# EAGLE design mbed-014.1 (EAGLE 6.2)

## Sheet 1 of 3
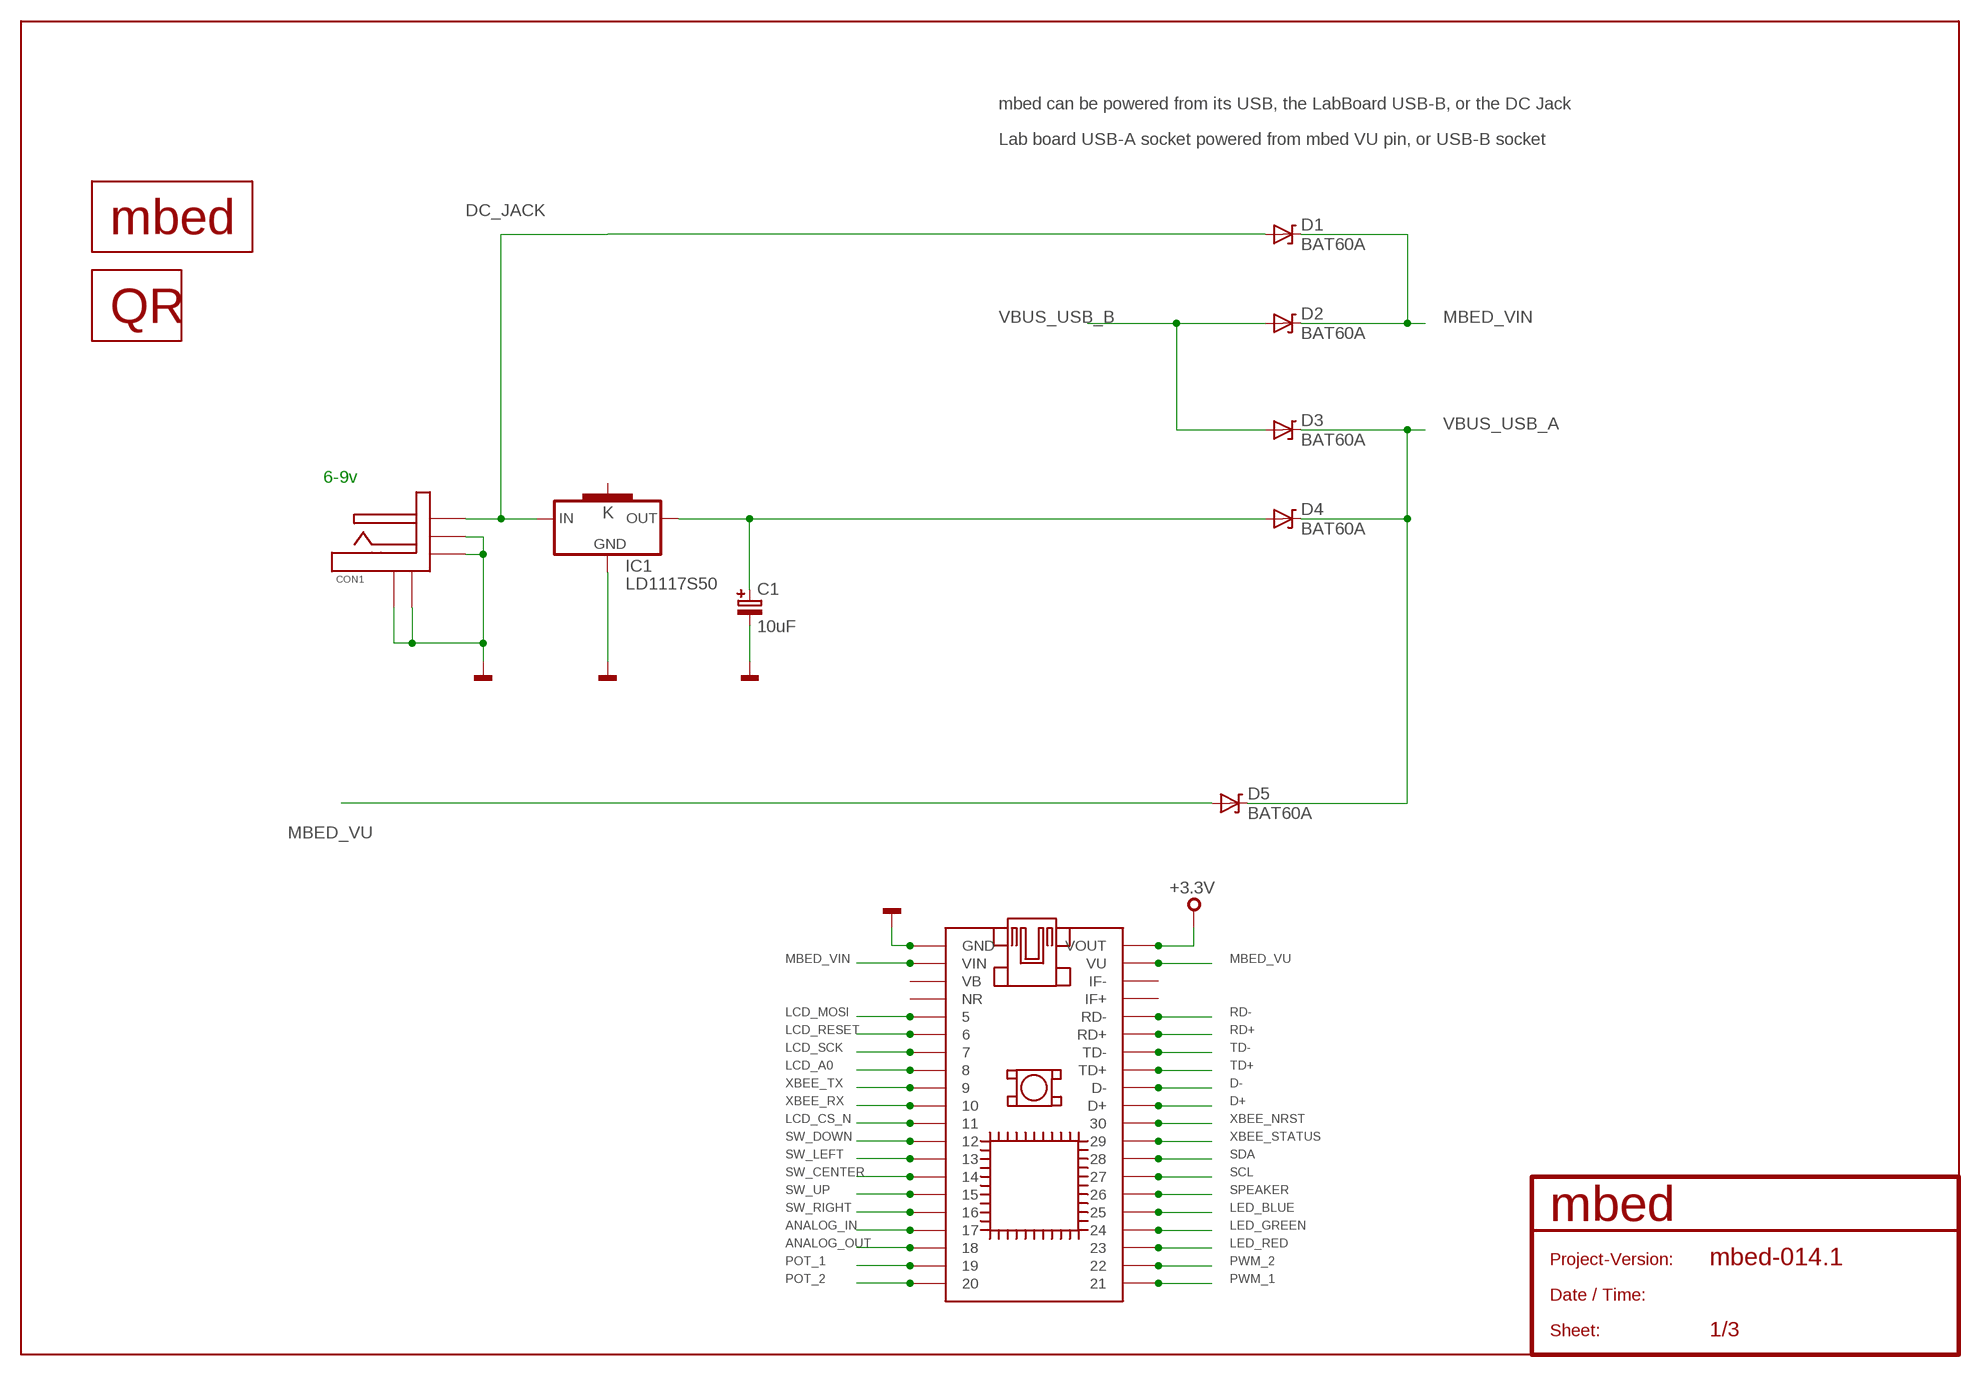
[diagram p0: schematic, sheet 1]

### Parts
C1  10uF  C-POLARISEDSMT_TANTALUM  [C106B]
CON1  FC68145S  [FC68145S]
D1  BAT60A  [BAT60A]
D2  BAT60A  [BAT60A]
D3  BAT60A  [BAT60A]
D4  BAT60A  [BAT60A]
D5  BAT60A  [BAT60A]
IC1  LD1117S50  LD1117S33  [SOT223]
IC2  MBED-SOCKET  [MBED-SOCKET]
QR1  QR-CODE-APP  [QR-MBED-APP-BOARD]
U$1  MBED-LOGO-BIG  [MBED-LOGO-BIG]

### Nets
+3,3V: IC2.VOUT IC2.VOUTA ; supply symbol labelled +3.3V ; also sheet 2,3
ANALOG_IN: IC2.17 IC2.17A ; also sheet 2
ANALOG_OUT: IC2.18 IC2.18A ; also sheet 2
D+: IC2.D+ IC2.D+A ; also sheet 2
D-: IC2.D- IC2.D-A ; also sheet 2
DC_JACK: CON1.TIP D1.A IC1.3(IN) ; also sheet 2
GND: C1.2 CON1.CASE1 CON1.P$5(CASE2) CON1.SHUNT(SWITCHED) CON1.SLEEVE IC1.1(GND) IC2.GND IC2.GNDA ; also sheet 2,3
LCD_A0: IC2.8 IC2.8A ; also sheet 2
LCD_CS_N: IC2.11 IC2.11A ; also sheet 2
LCD_MOSI: IC2.5 IC2.5A ; also sheet 2
LCD_RESET: IC2.6 IC2.6A ; also sheet 2
LCD_SCK: IC2.7 IC2.7A ; also sheet 2
LED_BLUE: IC2.25 IC2.25A ; also sheet 2
LED_GREEN: IC2.24 IC2.24A ; also sheet 2
LED_RED: IC2.23 IC2.23A ; also sheet 2
MBED_VIN: D1.K D2.K IC2.VIN IC2.VINA
MBED_VU: D5.A IC2.VU IC2.VUA
N$2: C1.1 D4.A IC1.2(OUT)
POT_1: IC2.19 IC2.19A ; also sheet 2
POT_2: IC2.20 IC2.20A ; also sheet 2
PWM_1: IC2.21 IC2.21A ; also sheet 2
PWM_2: IC2.22 IC2.22A ; also sheet 2
RD+: IC2.RD+ IC2.RD+A ; also sheet 2
RD-: IC2.RD- IC2.RD-A ; also sheet 2
SCL: IC2.27 IC2.27A ; also sheet 2
SDA: IC2.28 IC2.28A ; also sheet 2
SPEAKER: IC2.26 IC2.26A ; also sheet 2
SW_CENTER: IC2.14 IC2.14A ; also sheet 2
SW_DOWN: IC2.12 IC2.12A ; also sheet 2
SW_LEFT: IC2.13 IC2.13A ; also sheet 2
SW_RIGHT: IC2.16 IC2.16A ; also sheet 2
SW_UP: IC2.15 IC2.15A ; also sheet 2
TD+: IC2.TD+ IC2.TD+A ; also sheet 2
TD-: IC2.TD- IC2.TD-A ; also sheet 2
VBUS_USB_A: D3.K D4.K D5.K ; also sheet 2
VBUS_USB_B: D2.A D3.A ; also sheet 2
XBEE_NRST: IC2.30 IC2.30A ; also sheet 3
XBEE_RX: IC2.10 IC2.10A ; also sheet 3
XBEE_STATUS: IC2.29 IC2.29A ; also sheet 3
XBEE_TX: IC2.9 IC2.9A ; also sheet 3
Unconnected: IC1.4(K) IC2.IF+ IC2.IF+A IC2.IF- IC2.IF-A IC2.NR IC2.NRA IC2.VB IC2.VBA

### Notes on the sheet
- mbed can be powered from its USB, the LabBoard USB-B, or the DC Jack
- Lab board USB-A socket powered from mbed VU pin, or USB-B socket
- 6-9v

## Sheet 2 of 3
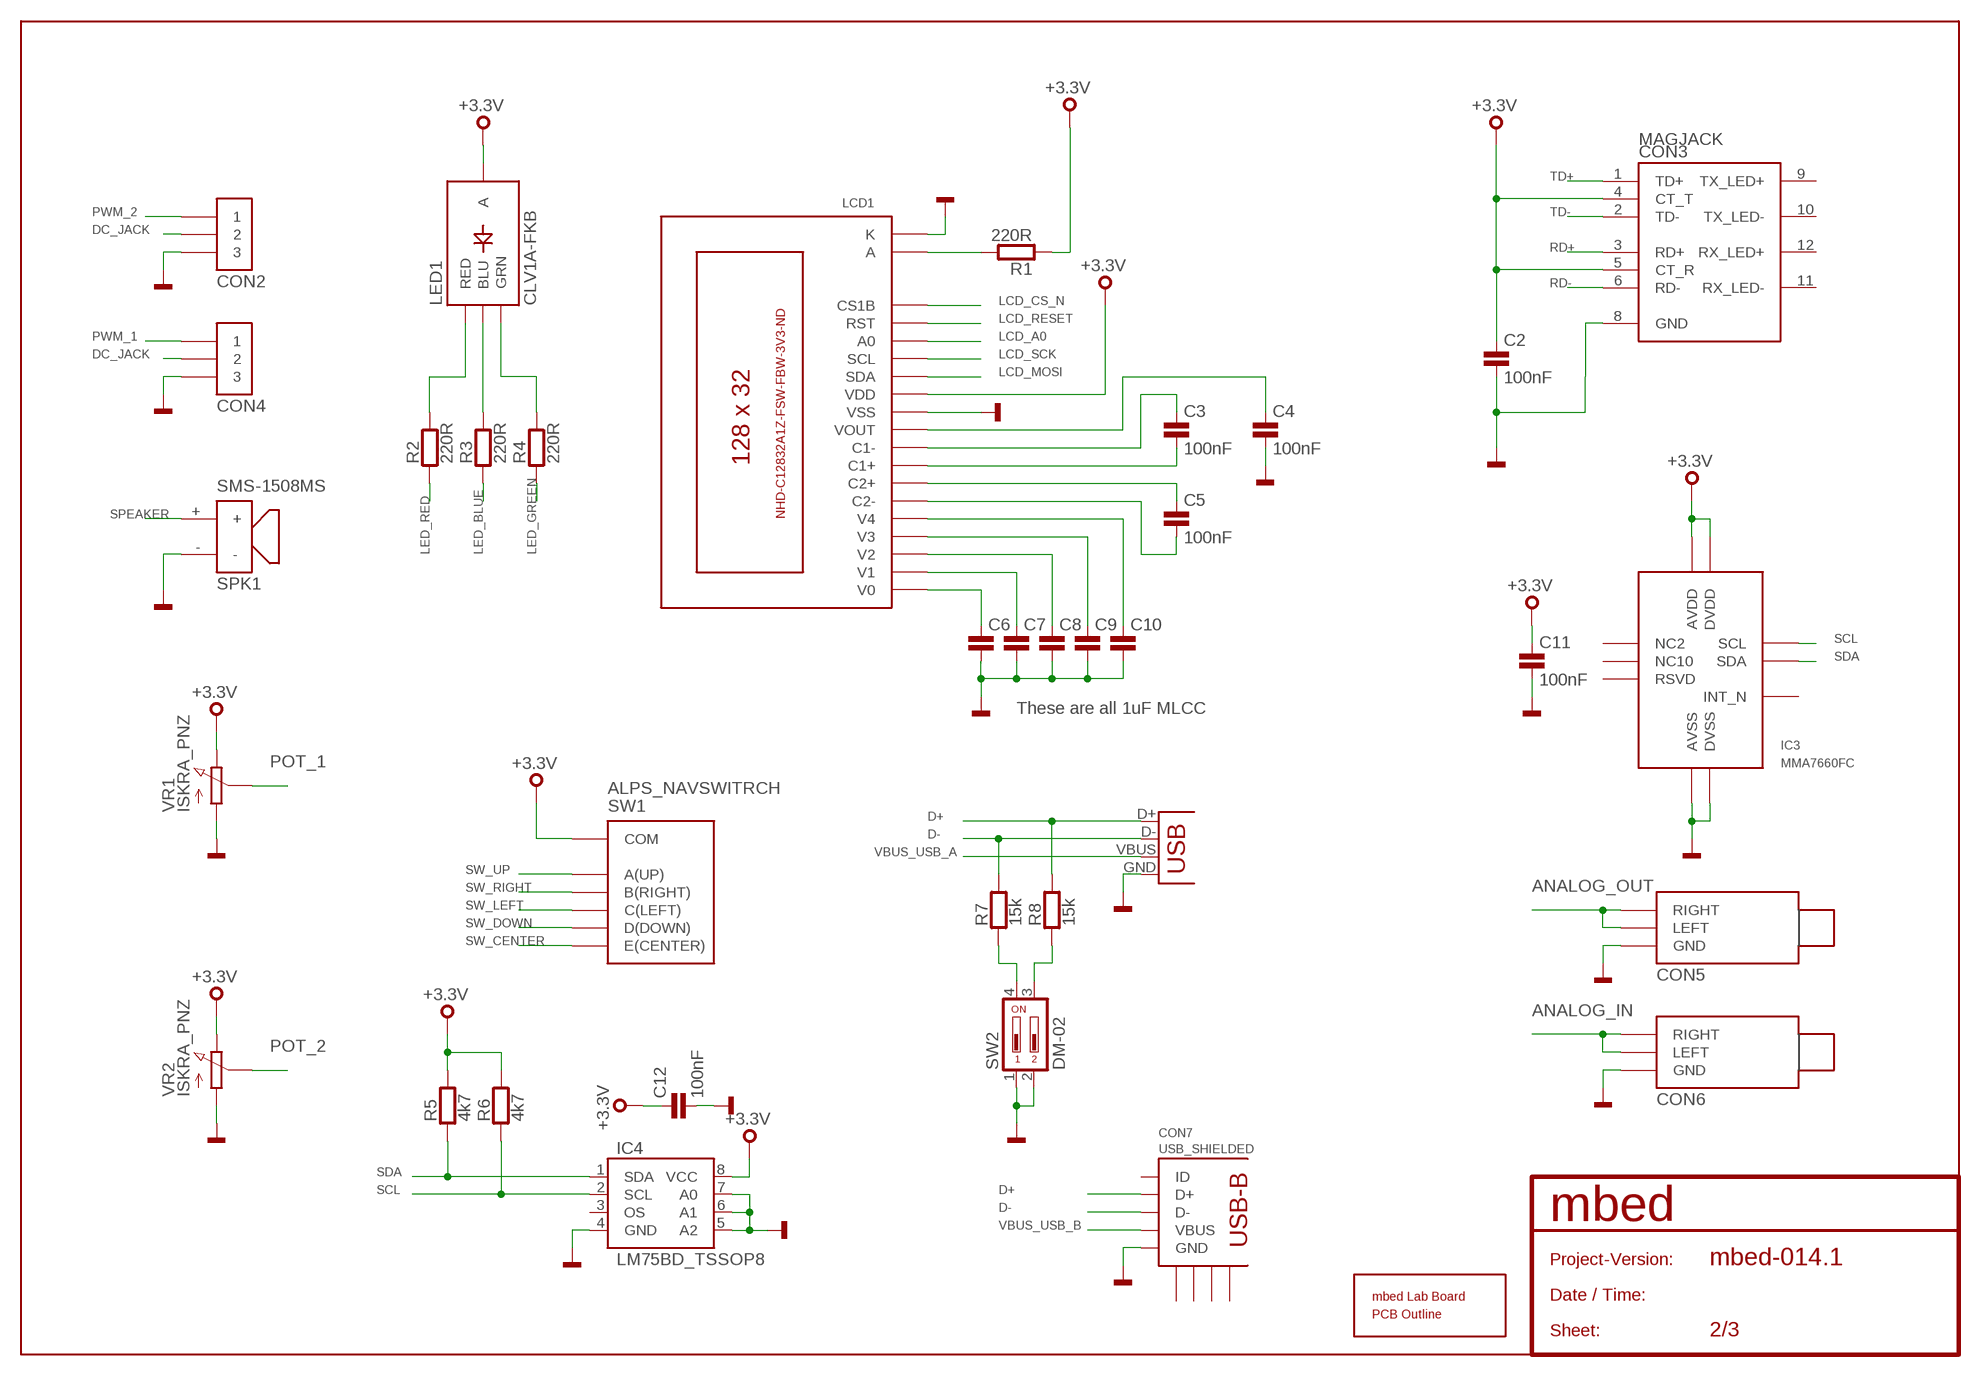
[diagram p1: schematic, sheet 2]

### Parts
C2  100nF  C0402  [0402]
C3  100nF  C0402  [0402]
C4  100nF  C0402  [0402]
C5  100nF  C0402  [0402]
C6  100nF  C0402  [0402]
C7  100nF  C0402  [0402]
C8  100nF  C0402  [0402]
C9  100nF  C0402  [0402]
C10  100nF  C0402  [0402]
C11  100nF  C0402  [0402]
C12  100nF  C0402  [0402]
CON2  1X3-HOLES  [1X3-HOLES]
CON3  MAGJACK  [MAGJACK]
CON4  1X3-HOLES  [1X3-HOLES]
CON5  3.5MM_STEREO  [3.5MM_STEREO]
CON6  3.5MM_STEREO  [3.5MM_STEREO]
CON7  USB_SHIELDED  [5075ABMR-05-SM1]
IC3  MMA7660FC  [DFN10-3X3MM]
IC4  LM75BD_TSSOP8  [TSSOP8]
LCD1  C12832A1Z  [C12832A1Z]
LED1  CLV1A-FKB  [PLCC-4]
PCB1  LAB_BOARD_OUTLINE  [LAB_BOARD_OUTLINE]
R1  220R  R0402  [0402]
R2  220R  R0402  [0402]
R3  220R  R0402  [0402]
R4  220R  R0402  [0402]
R5  4k7  R0402  [0402]
R6  4k7  R0402  [0402]
R7  15k  R0402  [0402]
R8  15k  R0402  [0402]
SPK1  SMS-1508MS  [SMS-1508MS-R]
SW1  ALPS_NAVSWITRCH  [SKRHA_SERIES]
SW2  DM-02  [DM-02]
VR1  ISKRA_PNZ  [CA14V]
VR2  ISKRA_PNZ  [CA14V]
X1  USB-A-V  [USB-A-V]

### Nets
+3,3V: C2.1 C11.1 C12.1 CON3.4(CT_T) CON3.5(CT_R) IC3.P$3(AVDD) IC3.P$9(DVDD) IC4.8(VCC) LCD1.P$12(VDD) LED1.2(A) R1.1 R5.2 R6.2 SW1.P$5(COM) VR1.P$3(E) VR2.P$3(E) ; supply symbol labelled +3.3V ; also sheet 1,3
ANALOG_IN: CON6.P$2(LEFT) CON6.P$3(RIGHT) ; also sheet 1
ANALOG_OUT: CON5.P$2(LEFT) CON5.P$3(RIGHT) ; also sheet 1
D+: CON7.D+ R8.2 X1.D+ ; also sheet 1
D-: CON7.D- R7.2 X1.D- ; also sheet 1
DC_JACK: CON2.P$2 CON4.P$2 ; also sheet 1
GND: C2.2 C4.2 C6.2 C7.2 C8.2 C9.2 C10.2 C11.2 C12.2 CON2.P$3 CON3.8(GND) CON4.P$3 CON5.P$1(GND) CON6.P$1(GND) CON7.GND IC3.P$4(AVSS) IC3.P$8(DVSS) IC4.4(GND) IC4.5(A2) IC4.6(A1) IC4.7(A0) LCD1.K LCD1.P$11(VSS) SPK1.- SW2.1 SW2.2 VR1.P$1(A) VR2.P$1(A) X1.GND ; also sheet 1,3
LCD_A0: LCD1.P$15(A0) ; also sheet 1
LCD_CS_N: LCD1.P$17(CS1B) ; also sheet 1
LCD_MOSI: LCD1.P$13(SDA) ; also sheet 1
LCD_RESET: LCD1.P$16(RST) ; also sheet 1
LCD_SCK: LCD1.P$14(SCL) ; also sheet 1
LED_BLUE: R3.1 ; also sheet 1
LED_GREEN: R4.1 ; also sheet 1
LED_RED: R2.1 ; also sheet 1
N$1: LCD1.A R1.2
N$3: R7.1 SW2.4
N$4: R8.1 SW2.3
N$7: C3.1 LCD1.P$9(C1-)
N$8: C3.2 LCD1.P$8(C1+)
N$9: C5.1 LCD1.P$7(C2+)
N$10: C5.2 LCD1.P$6(C2-)
N$11: C6.1 LCD1.P$1(V0)
N$12: C7.1 LCD1.P$2(V1)
N$14: C8.1 LCD1.P$3(V2)
N$15: C9.1 LCD1.P$4(V3)
N$16: C10.1 LCD1.P$5(V4)
N$17: LED1.1(RED) R2.2
N$18: C4.1 LCD1.P$10(VOUT)
N$19: LED1.4(GRN) R4.2
N$20: LED1.3(BLU) R3.2
POT_1: VR1.P$2(S) ; also sheet 1
POT_2: VR2.P$2(S) ; also sheet 1
PWM_1: CON4.P$1 ; also sheet 1
PWM_2: CON2.P$1 ; also sheet 1
RD+: CON3.3(RD+) ; also sheet 1
RD-: CON3.6(RD-) ; also sheet 1
SCL: IC3.P$6(SCL) IC4.2(SCL) R6.1 ; also sheet 1
SDA: IC3.P$7(SDA) IC4.1(SDA) R5.1 ; also sheet 1
SPEAKER: SPK1.+ ; also sheet 1
SW_CENTER: SW1.P$2(E(CENTER)) ; also sheet 1
SW_DOWN: SW1.P$4(D(DOWN)) ; also sheet 1
SW_LEFT: SW1.P$1(C(LEFT)) ; also sheet 1
SW_RIGHT: SW1.P$6(B(RIGHT)) ; also sheet 1
SW_UP: SW1.P$3(A(UP)) ; also sheet 1
TD+: CON3.1(TD+) ; also sheet 1
TD-: CON3.2(TD-) ; also sheet 1
VBUS_USB_A: X1.VBUS ; also sheet 1
VBUS_USB_B: CON7.VBUS ; also sheet 1
Unconnected: CON3.9(TX_LED+) CON3.10(TX_LED-) CON3.11(RX_LED-) CON3.12(RX_LED+) CON7.ID CON7.SHIELD@1 CON7.SHIELD@2 CON7.SHIELD@3 CON7.SHIELD@4 IC3.P$1(RSVD) IC3.P$2(NC2) IC3.P$5(INT_N) IC3.P$10(NC10) IC4.3(OS)

### Notes on the sheet
- These are all 1uF MLCC

## Sheet 3 of 3
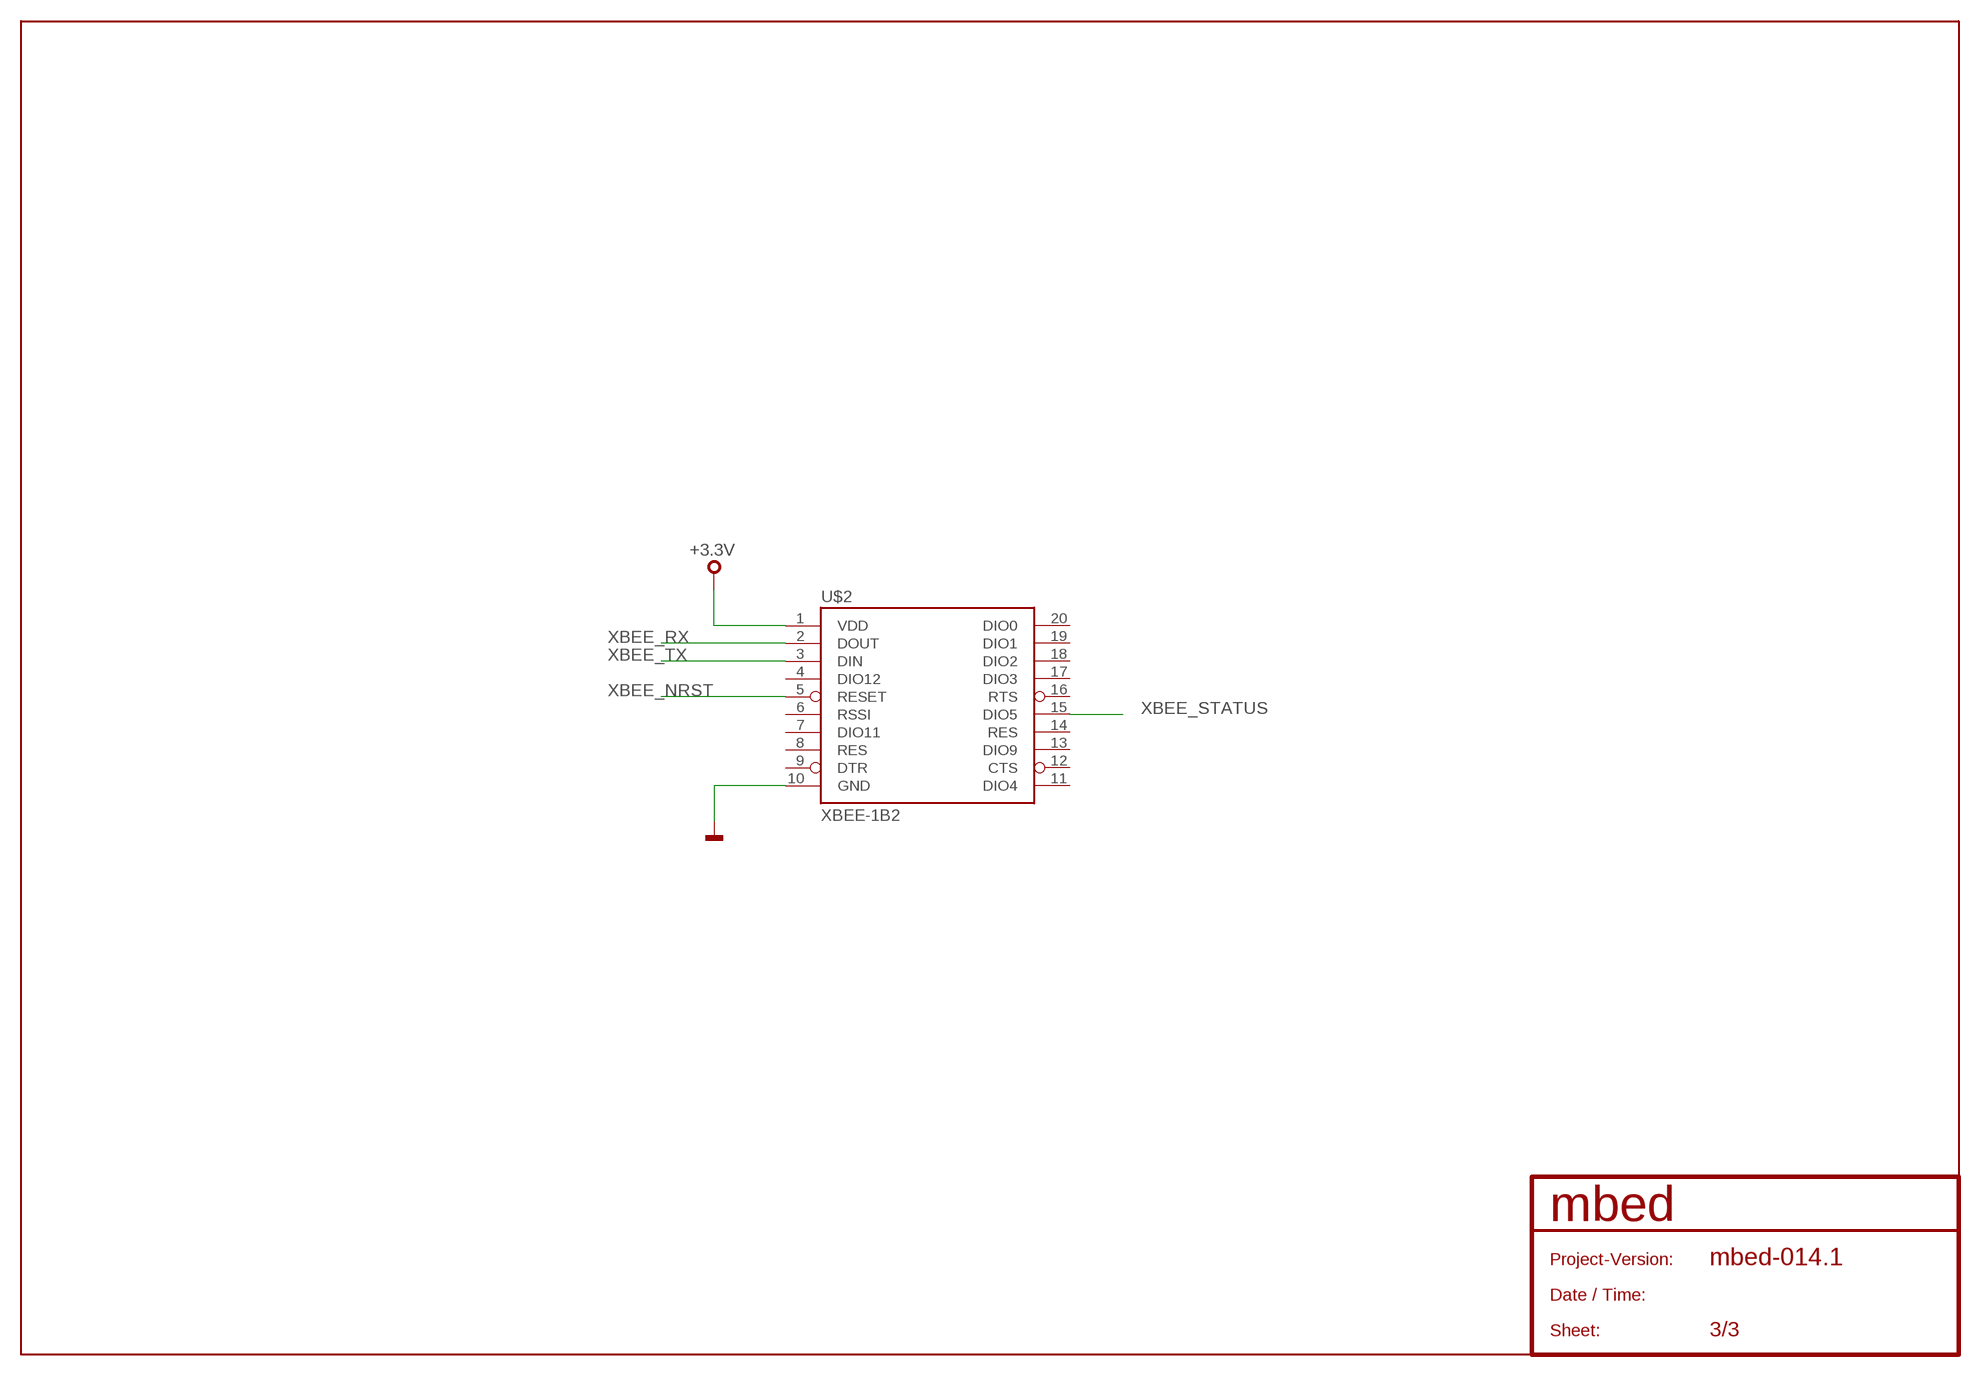
[diagram p2: schematic, sheet 3]

### Parts
U$2  XBEE-1B2  [XBEE-SILK]

### Nets
+3,3V: U$2.1(VDD) ; supply symbol labelled +3.3V ; also sheet 1,2
GND: U$2.10(GND) ; also sheet 1,2
XBEE_NRST: U$2.5(RESET) ; also sheet 1
XBEE_RX: U$2.2(DOUT) ; also sheet 1
XBEE_STATUS: U$2.15(DIO5) ; also sheet 1
XBEE_TX: U$2.3(DIN) ; also sheet 1
Unconnected: U$2.4(DIO12) U$2.6(RSSI) U$2.7(DIO11) U$2.8(RES) U$2.9(DTR) U$2.11(DIO4) U$2.12(CTS) U$2.13(DIO9) U$2.14(RES) U$2.16(RTS) U$2.17(DIO3) U$2.18(DIO2) U$2.19(DIO1) U$2.20(DIO0)

## Library data of the parts
C1 = mbed-rlcq:C-POLARISED
C2-C12 = mbed-rlcq:C
CON1 = LabBoard:FC68145S
CON2 CON4 = LabBoard:1X3-HOLES
CON3 = LabBoard:MAGJACK
CON5 CON6 = LabBoard:3.5MM_STEREO
CON7 = mbed-connectors:USB_SHIELDED
D1-D5 = mbed-discrete:BAT60A
IC1 = mbed-ics:LD1117S33: VOLTAGE REGULATOR SMD 3,3V
IC2 = mbed-microcontroller:MBED-SOCKET
IC3 = LabBoard:MMA7660FC
IC4 = LabBoard:LM75BD
LCD1 = LabBoard:C12832A1Z
LED1 = LabBoard:CLV1A-FKB: Tri-Color LED SMD Proven layout and schematic for triple color LED in SMD package - common anode. Spark Fun Electronics SKU : COM-07844
PCB1 = LabBoard:LAB_BOARD_OUTLINE
QR1 = LabBoard:QR-CODE
R1-R8 = mbed-rlcq:R
SPK1 = LabBoard:SMS-1508MS
SW1 = LabBoard:ALPS_NAVSWITRCH
SW2 = LabBoard:DM-02
U$1 = LabBoard:MBED-LOGO
U$2 = LabBoard:XBEE-1
VR1 VR2 = LabBoard:ISKRA_PNZ
X1 = mbed-connectors:USB: USB Connectors

## Board
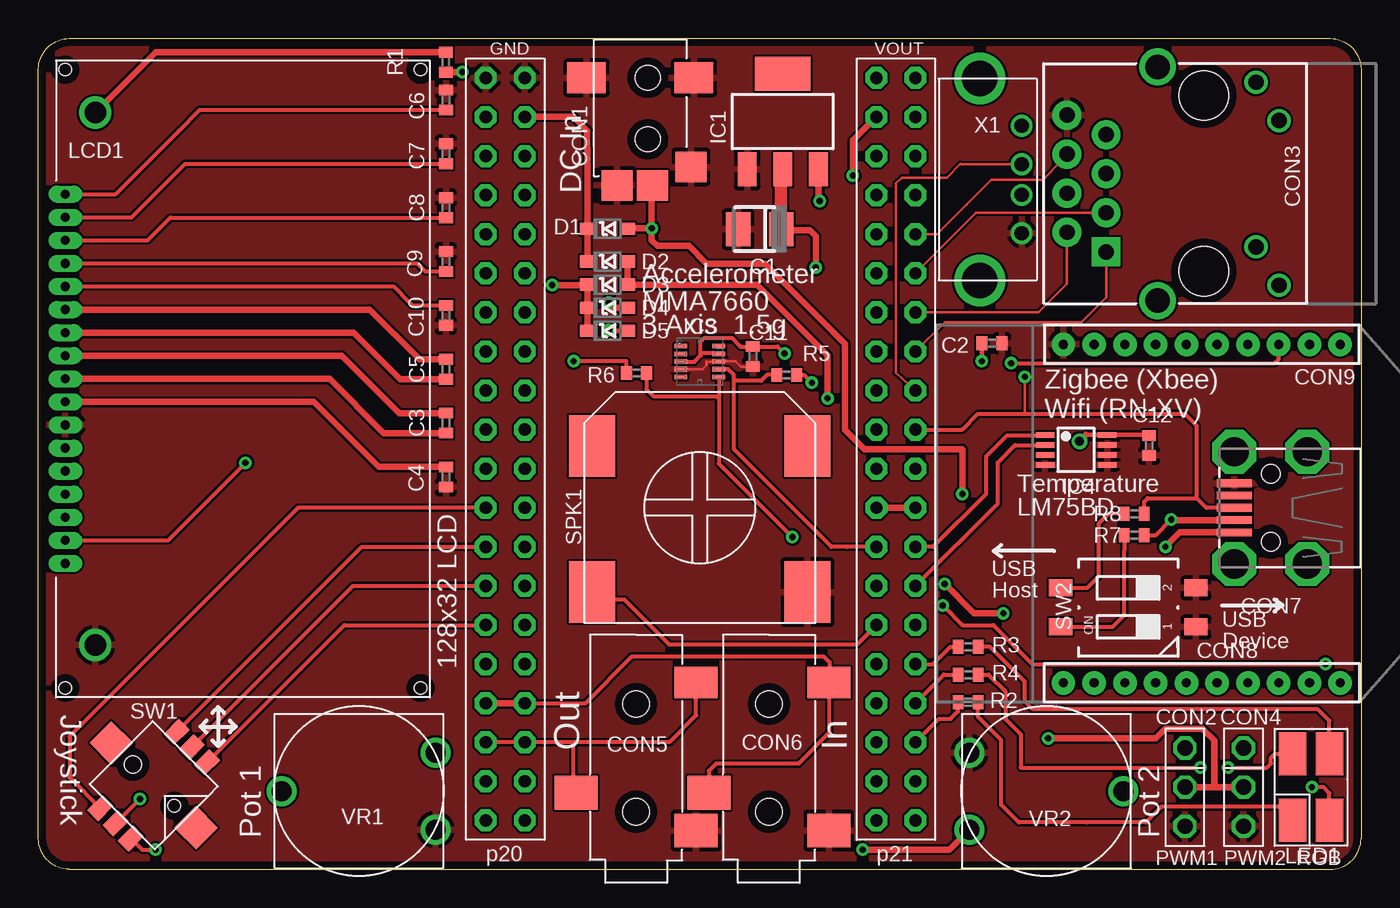
[diagram p3: board, top side]
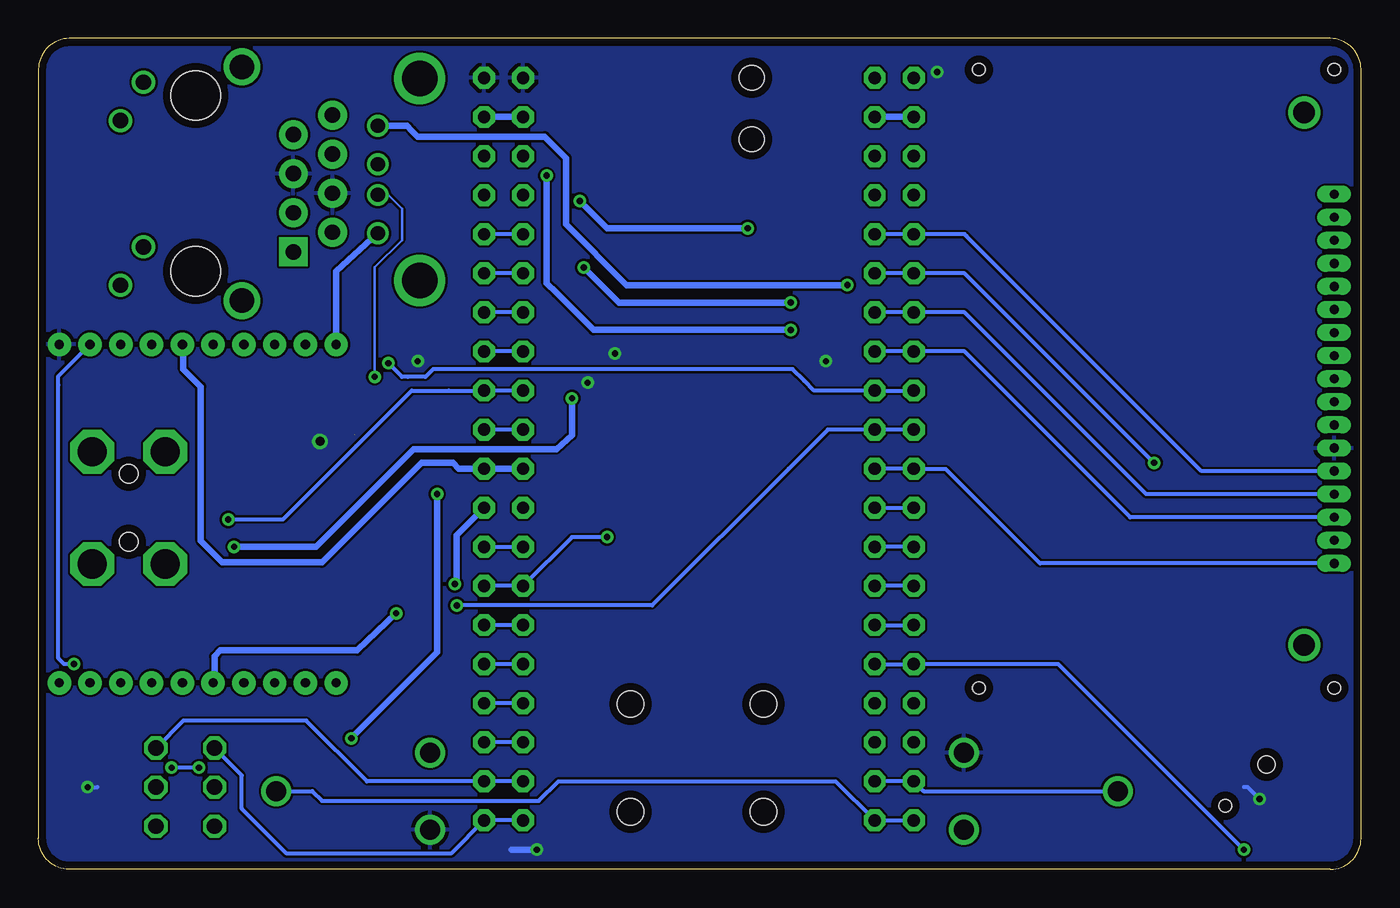
[diagram p4: board, bottom side, seen from below]

Size 86 x 54 mm. Coordinates in mm from the lower left corner, seen from the top.
Copper layers (1*16): Top 0.035mm / dielectric 1.5mm / Bottom 0.035mm
Design rules: minimum track width 6mil, minimum drill 15mil, track to track 6mil, track to pad 6mil, pad to pad 6mil, via to via 6mil, smd to smd 6mil, copper to edge 20mil, drill to drill 8mil, minimum pad ring 10mil, minimum via ring 8mil, stop-mask expansion 4mil, vias tented up to drill 0mil, thermal gap 10mil

### Footprints (pad centres in the part's own frame; a part is rotated, then mirrored left to right if it is on the bottom)
C106B = smd 1.6 x 2.2: 1 -1.4,0; 2 1.4,0
0402 = smd 0.7 x 0.9: 1 -0.65,0; 2 0.65,0
FC68145S = smd 2.5 x 2: CASE1 -4,4; P$5 3,4 | smd 2 x 2: SHUNT 2.8,-1.8; SLEEVE -2,-3; TIP 0.3,-3 | hole 1.6: 0,0; 0,4
1X3-HOLES = drill 1 octagon: P$1 0,0; P$2 0,-2.54; P$3 0,-5.08
MAGJACK = drill 1 pad 1.88 square: 1 3.175,17.445 | drill 1 pad 1.88: 2 4.445,19.985; 3 5.715,17.445; 4 6.985,19.985; 5 8.255,17.445; 6 9.525,19.985; 7 10.795,17.445; 8 12.065,19.985 | drill 1 pad 1.27: 9 1,6.2; 10 3.5,7.7; 11 11.7,6.2; 12 14.2,7.7 | drill 1.6 pad 2.184: M1 0,14.1; M2 15.2,14.1 | hole 3.2: 1.905,11.095; 13.335,11.095
3.5MM_STEREO = smd 2.2 x 2.8: P$1 12.727,3.9; P$3 10.273,-3.9 | smd 2.05 x 2.8: P$2 3.1,3.9 | hole 1.7: 4.5,0; 11.5,0
5075ABMR-05-SM1 = smd 2.25 x 0.5: D+ 2.375,0; D- 2.375,0.8; GND 2.375,-1.6; ID 2.375,-0.8; VBUS 2.375,1.6 | drill 1.9 pad 2.5 octagon: SHIELD@1 -2.375,3.65; SHIELD@2 2.375,3.65; SHIELD@3 -2.375,-3.65; SHIELD@4 2.375,-3.65 | hole 1.2: 0,2.2; 0,-2.2
BAT60A = smd 1 x 0.8: A 1.3,0; K -1.3,0
SOT223 = smd 1.219 x 2.235: 1 -2.311,-3.099; 2 0,-3.099; 3 2.311,-3.099 | smd 3.6 x 2.2: 4 0,3.099
MBED-SOCKET = drill 0.8 pad 1.422 octagon: 5 -2.54,-10.16; 5A 0,-10.16; 6 -2.54,-12.7; 6A 0,-12.7; 7 -2.54,-15.24; 7A 0,-15.24; 8 -2.54,-17.78; 8A 0,-17.78; 9 -2.54,-20.32; 9A 0,-20.32; 10 -2.54,-22.86; 10A 0,-22.86; 11 -2.54,-25.4; 11A 0,-25.4; 12 -2.54,-27.94; 12A 0,-27.94; 13 -2.54,-30.48; 13A 0,-30.48; 14 -2.54,-33.02; 14A 0,-33.02; 15 -2.54,-35.56; 15A 0,-35.56; 16 -2.54,-38.1; 16A 0,-38.1; 17 -2.54,-40.64; 17A 0,-40.64; 18 -2.54,-43.18; 18A 0,-43.18; 19 -2.54,-45.72; 19A 0,-45.72; 20 -2.54,-48.26; 20A 0,-48.26; 21 25.4,-48.26; 21A 22.86,-48.26; 22 25.4,-45.72; 22A 22.86,-45.72; 23 25.4,-43.18; 23A 22.86,-43.18; 24 25.4,-40.64; 24A 22.86,-40.64; 25 25.4,-38.1; 25A 22.86,-38.1; 26 25.4,-35.56; 26A 22.86,-35.56; 27 25.4,-33.02; 27A 22.86,-33.02; 28 25.4,-30.48; 28A 22.86,-30.48; 29 25.4,-27.94; 29A 22.86,-27.94; 30 25.4,-25.4; 30A 22.86,-25.4; D+ 25.4,-22.86; D+A 22.86,-22.86; D- 25.4,-20.32; D-A 22.86,-20.32; GND -2.54,0; GNDA 0,0; IF+ 25.4,-7.62; IF+A 22.86,-7.62; IF- 25.4,-5.08; IF-A 22.86,-5.08; NR -2.54,-7.62; NRA 0,-7.62; RD+ 25.4,-12.7; RD+A 22.86,-12.7; RD- 25.4,-10.16; RD-A 22.86,-10.16; TD+ 25.4,-17.78; TD+A 22.86,-17.78; TD- 25.4,-15.24; TD-A 22.86,-15.24; VB -2.54,-5.08; VBA 0,-5.08; VIN -2.54,-2.54; VINA 0,-2.54; VOUT 25.4,0; VOUTA 22.86,0; VU 25.4,-2.54; VUA 22.86,-2.54
DFN10-3X3MM = smd 0.825 x 0.3: P$1 -1.24,1; P$2 -1.24,0.5; P$3 -1.24,0; P$4 -1.24,-0.5; P$5 -1.24,-1; P$6 1.24,-1; P$7 1.24,-0.5; P$8 1.24,0; P$9 1.24,0.5; P$10 1.24,1
TSSOP8 = smd 1.2 x 0.35: 1 -2.025,0.975; 2 -2.025,0.325; 3 -2.025,-0.325; 4 -2.025,-0.975; 5 2.025,-0.975; 6 2.025,-0.325; 7 2.025,0.325; 8 2.025,0.975
C12832A1Z = drill 1.4: A 3.4,2.55; K 38,2.55 | drill 0.6 long: P$1 8.7,0.6; P$2 10.2,0.6; P$3 11.7,0.6; P$4 13.2,0.6; P$5 14.7,0.6; P$6 16.2,0.6; P$7 17.7,0.6; P$8 19.2,0.6; P$9 20.7,0.6; P$10 22.2,0.6; P$11 23.7,0.6; P$12 25.2,0.6; P$13 26.7,0.6; P$14 28.2,0.6; P$15 29.7,0.6; P$16 31.2,0.6; P$17 32.7,0.6 | hole 0.8: 0.6,0.6; 40.8,0.6; 40.8,23.7; 0.6,23.7
PLCC-4 = smd 2.794 x 1.778: 1 -2.159,1.27; 2 -2.159,-1.143; 3 2.159,-1.143; 4 2.159,1.27
SMS-1508MS-R = smd 3 x 4: + -7,-5.5; - 7,-5.5; P$3 7,4; P$4 -7,4
SKRHA_SERIES = smd 1.4 x 1: P$1 -3.5,-1.4; P$2 -3.5,0; P$3 -3.5,1.4; P$4 3.5,-1.4; P$5 3.5,0; P$6 3.5,1.4 | smd 2 x 2: P$7 0,3.9; P$8 0,-3.9 | hole 0.8: 0,1.9 | hole 1.1: 0,-1.9
DM-02 = smd 1.1 x 1.5: 1 -1.27,-4.4; 2 1.27,-4.4; 3 1.27,4.4; 4 -1.27,4.4
XBEE-SILK = drill 0.6 pad 1.524: 1 -11,20; 2 -11,18; 3 -11,16; 4 -11,14; 5 -11,12; 6 -11,10; 7 -11,8; 8 -11,6; 9 -11,4; 10 -11,2; 11 11,2; 12 11,4; 13 11,6; 14 11,8; 15 11,10; 16 11,12; 17 11,14; 18 11,16; 19 11,18; 20 11,20
CA14V = drill 1.3: P$1 -2.5,-5; P$2 0,5; P$3 2.5,-5
USB-A-V = drill 0.914: D+ 2.718,0.267; D- 2.718,2.273; GND 2.718,-2.223; VBUS 2.718,4.763 | drill 2.311: P$5 0,-5.296; P$6 0,7.836

### Placement (x,y rotation side)
C1  46.89,41.6 180 top
C2  62,34.2 0 top
C3  26.5,29 90 top
C4  26.5,25.5 270 top
C5  26.5,32.5 90 top
C6  26.5,50 90 top
C7  26.5,46.5 90 top
C8  26.5,43 90 top
C9  26.5,39.5 90 top
C10  26.5,36 270 top
C11  46.45,33.33 270 top
C12  72.22,27.55 270 top
CON1  39.62,47.44 0 top
CON2  78.36,7.87 0 top
CON3  86.87,36.96 90 top
CON4  74.55,7.87 0 top
CON5  38.86,15.24 270 top
CON6  47.5,15.24 270 top
CON7  80.14,23.5 180 top
D1  37,41.63 0 top
D2  37,39.5 0 top
D3  37,38 0 top
D4  37,36.5 0 top
D5  37,35 0 top
IC1  48.4,48.6 0 top
IC2  31.62,51.44 0 top
IC3  43,33 0 top
IC4  67.47,27.25 0 top
LCD1  1.14,52.58 270 top
LED1  82.8,5.33 90 top
PCB1  0,0 0 top
QR1  53.21,12.57 0 bottom
R1  26.49,52.45 90 top
R2  60.45,10.86 0 top
R3  60.45,14.46 0 top
R4  60.45,12.65 0 top
R5  48.65,32.13 0 top
R6  38.88,32.26 180 top
R7  71.25,21.72 0 top
R8  71.25,23.11 0 top
SPK1  43,23.51 0 top
SW1  7.49,5.46 225 top
SW2  70.87,17.02 90 top
U$1  52.2,38.73 0 bottom
U$2  64.64,23.11 270 top
VR1  20.83,5.08 90 top
VR2  65.53,5.08 270 top
X1  61.21,43.56 0 top

### Tracks (layer width: path | path; a pad name or v marks a point on that pad's centre or on a via)
+3,3V  (via drill 0.41, 0.6 pad 0.41)
  Top 0.254: SW1.P$5 v6.6,4.57 | LED1.2 83.95,4.95 83.57,5.33 v82.8,5.33 | v48.51,33.53 48.06,33.98 C11.1 45.65,33.98 45.59,34.04 45.09,34.54 43.31,34.54 43.05,34.29 43.05,33.53 | 72.18,28.23 C12.1 | IC3.P$3 42.65,33 43.05,33.4 43.05,33.53 | IC3.P$9 44.21,33.53 43.05,33.53 | R5.2 49.79,32.13 v50.29,31.62 | R6.2 38.23,33.02 v34.8,33.02
  Top 0.305: C2.1 v61.35,33.03 v61.34,33.02 | 68.11,28.23 IC4.8 72.18,28.23
  Top 0.406: VR2.P$3 59.22,1.27 v53.59,1.27 | 68.11,28.23 v67.69,27.81 | R1.1 27.04,51.8 v27.56,51.82
  Bottom 0.254: v6.6,4.57 7.37,5.33 7.62,5.33 | v82.8,5.33 82.17,5.33 | v48.51,33.53 48.64,33.4
  Bottom 0.305: v61.34,33.02 61.34,32.89
  Bottom 0.406: v53.59,1.27 55.24,1.27
  pour Bottom: 0,0 86,0 86,54 0,54
ANALOG_IN
  Top 0.254: IC2.17A 35.56,10.79 38.61,13.84 51.05,13.84 51.44,13.46 51.44,12.18 CON6.P$2 51.44,11.6 51.44,8.89 49.4,6.86 44.07,6.86 43.6,6.39 CON6.P$3
  Top 0.406: IC2.17 IC2.17A
ANALOG_OUT
  Top 0.254: IC2.18 IC2.18A 34.8,8.26 | CON5.P$2 42.76,10 41.02,8.26 34.8,8.26 | CON5.P$3 34.8,5.13 34.8,8.26
D+  (via drill 0.41)
  Top 0.152: v64.14,32 64.14,29.59 64.01,29.59
  Top 0.254: IC2.D+ 60.07,28.57 61.09,29.59 64.01,29.59 64.14,29.59 64.77,29.59 74.55,29.59 75.31,28.83 75.31,24.13 | CON7.D+ 75.95,23.5 75.31,24.13 | R8.2 71.9,23.89 72.14,24.13 75.31,24.13
  Bottom 0.152: X1.D+ 63.26,43.83 62.36,42.93 62.36,40.89 64.14,39.12 v64.14,32
  Bottom 0.254: IC2.D+A IC2.D+
D-  (via drill 0.41)
  Top 0.152: IC2.D- 55.75,32.26 55.75,44.45 55.75,44.58 56.13,44.96 59.05,44.96 59.94,45.85 59.96,45.83 X1.D-
  Top 0.254: 73.7,22.7 v73.66,22.73 72.64,21.72 R7.2
  Top 0.406: 73.7,22.7 CON7.D-
  Bottom 0.254: IC2.D-A IC2.D- 59.31,31.11 61.72,31.11 70.1,22.73 v73.66,22.73
DC_JACK  (via drill 0.41)
  Top 0.305: 39.88,44.4 CON1.TIP | 50.71,43.52 v50.8,43.43
  Top 0.406: v39.88,41.66 39.88,44.4 | IC1.3 50.71,43.52 | CON2.P$2 76.58,5.33 | 76.58,5.33 CON4.P$2 | v60.07,24.38 60.07,27.3 53.72,27.3 52.45,28.57 52.45,30.35 52.45,34.16 47.24,39.37 43.43,39.37 42.29,40.51 40.39,40.51 40.26,40.51 39.88,40.89 v39.88,41.66 | v65.66,8.51 71.75,8.51 72.64,8.51 73.28,9.14 75.69,9.14 76.45,8.38 76.45,5.46 76.58,5.33 | D1.A 38.32,41.66 v39.88,41.66
  Bottom 0.406: v50.8,43.43 49.02,41.66 v39.88,41.66 | v60.07,24.38 60.07,14.1 v65.66,8.51
GND
  Top 0.152: C11.2 45.68,32.68 45.34,33.02 44.26,33.02 IC3.P$8 43.45,33 43.43,33.02 43.43,32.77 43.18,32.51 41.77,32.51 IC3.P$4
  Bottom 0.406: X1.GND 66.64,38.88 U$2.10
  pour Top: 0,0 0,54 86,54 86,0
LCD_A0
  Bottom 0.254: IC2.8A IC2.8 25.78,33.66 25.15,33.02 15,22.88 LCD1.P$15
LCD_CS_N
  Bottom 0.254: IC2.11A IC2.11 29.05,26 27,26 20.88,19.88 LCD1.P$17
LCD_MOSI
  Bottom 0.254: IC2.5A IC2.5 25.78,41.27 25.65,41.15 10.38,25.88 LCD1.P$13
LCD_RESET  (via drill 0.41)
  Top 0.254: LCD1.P$16 8.42,21.38 v13.46,26.42
  Bottom 0.254: IC2.6A IC2.6 25.78,38.73 v13.46,26.42
LCD_SCK
  Bottom 0.254: IC2.7A IC2.7 25.78,36.2 24.89,35.31 13.96,24.38 LCD1.P$14
LED_BLUE
  Top 0.254: IC2.25 58.17,13.34 58.67,13.84 59.29,14.46 R3.1
  Bottom 0.254: IC2.25A IC2.25
LED_GREEN
  Top 0.254: IC2.24 58.87,12.65 R4.1
  Bottom 0.254: IC2.24A IC2.24
LED_RED
  Top 0.254: IC2.23 58.55,9.78 59.31,9.78 59.8,10.27 R2.1
  Bottom 0.254: IC2.23A IC2.23
MBED_VIN
  Top 0.406: IC2.VINA 34.8,48.9 35.69,48.01 35.69,46.86 35.7,46.85 D1.K D2.K
  Bottom 0.406: IC2.VIN IC2.VINA
MBED_VU  (via drill 0.41)
  Top 0.305: D5.A 37.29,35 v37.08,35.05
  Top 0.406: v52.96,45.09 52.96,47.37 IC2.VUA
  Bottom 0.406: IC2.VUA IC2.VU | v37.08,35.05 49.91,35.05 52.32,37.47 52.96,38.1 v52.96,45.09
N$1
  Top 0.406: R1.2 7.62,53.1 LCD1.A
N$2  (via drill 0.41)
  Top 0.305: 48.36,41.53 C1.1
  Top 0.406: D4.A 37.39,36.5 v37.08,36.83 | v50.55,39.12 50.55,41.15 50.16,41.53 48.36,41.53
  Top 0.813: C1.1 48.29,45.39 IC1.2
  Bottom 0.406: v37.08,36.83 48.26,36.83 v50.55,39.12
N$3
  Top 0.254: R7.1 70.6,20.7 70.6,16.5 70.36,16.26 69.85,15.75 SW2.4
N$4
  Top 0.254: R8.1 69.6,23.11 68.96,22.48 68.96,19.05 68.2,18.29 SW2.3
N$7
  Top 0.254: 22.35,28.45 22.45,28.35
  Top 0.406: LCD1.P$9 18.92,31.88 22.35,28.45 | 22.45,28.35 C3.1
N$8
  Top 0.406: LCD1.P$8 19.71,33.38 23.11,29.97 23.44,29.65 C3.2
N$9
  Top 0.406: LCD1.P$7 20.49,34.88 23.37,32 23.52,31.85 C5.1
N$10
  Top 0.254: 24.64,33.27 24.76,33.15
  Top 0.406: LCD1.P$6 21.53,36.38 24.64,33.27 | 24.76,33.15 C5.2
N$11
  Top 0.254: LCD1.P$1 5.02,43.88 9.14,48.01 10.49,49.35 C6.1
N$12
  Top 0.254: LCD1.P$2 6.06,42.38 9.14,45.47 9.53,45.85 C7.1
N$14
  Top 0.254: LCD1.P$3 7.1,40.88 8.38,42.16 8.57,42.35 C8.1
N$15
  Top 0.254: LCD1.P$4 24.63,39.38 25.15,38.86 26.49,38.86 C9.1
N$16
  Top 0.254: LCD1.P$5 23.08,37.88 24.13,36.83 24.31,36.65 C10.1
N$17
  Top 0.254: LED1.1 80.64,4.06 77.98,4.06 73.03,4.06 72.01,3.05 68.2,3.05 63.75,3.05 62.61,4.19 62.61,8.38 61.09,9.91 61.09,10.59 R2.2
N$18
  Top 0.406: LCD1.P$10 17.88,30.38 21.84,26.42 22.11,26.15 C4.1
N$19  (via drill 0.41)
  Top 0.254: R4.2 61.78,12.65 62.87,11.56 62.87,9.78 63.88,8.76 63.88,6.6 v75.56,6.6 | LED1.4 80.39,7.49 80.14,7.24 80.14,6.86 79.88,6.6 v77.34,6.6
  Bottom 0.254: v75.56,6.6 v77.34,6.6
N$20
  Top 0.254: LED1.3 83.95,9.65 83.19,10.41 64.64,10.41 64.14,10.92 64.14,12.19 62.23,14.1 61.87,14.46 R3.2
POT_1
  Bottom 0.254: IC2.19A IC2.19 28.45,5.08 VR1.P$2
POT_2
  Bottom 0.254: IC2.20 IC2.20A 34.16,5.71 52.2,5.71 53.47,4.45 67.56,4.45 68.2,5.08 VR2.P$2
PWM_1
  Bottom 0.254: IC2.21A IC2.21 59.18,1.02 69.85,1.02 72.77,3.94 72.77,6.1 CON4.P$1
PWM_2
  Bottom 0.254: IC2.22A IC2.22 64.64,5.71 68.58,9.65 76.58,9.65 CON2.P$1
RD+
  Top 0.152: CON3.3 62.36,42.67 60.96,42.67 IC2.RD+
  Bottom 0.254: IC2.RD+A IC2.RD+
RD-
  Top 0.152: CON3.6 65.36,44.83 61.98,44.83 60.33,43.18 58.42,41.27 IC2.RD-
  Bottom 0.254: IC2.RD-A IC2.RD-
SCL  (via drill 0.41)  (1 unrouted)
  Top 0.254: IC3.P$6 44.24,30.61 | 44.24,30.61 44.24,26.37 v49.02,21.59 | IC2.27 62.38,23.77 62.38,26.44 63.5,27.56 65.42,27.56 65.44,27.58 | R6.1 39.53,31.21 40.01,30.73 44.11,30.73 44.24,30.61
  Bottom 0.254: IC2.27 IC2.27A 51.31,21.59 v49.02,21.59
SDA  (1 unrouted)
  Top 0.254: IC2.28A 52.59,20.95 51.56,20.95 47.75,24.77 45.21,27.3 45.21,31.75 | IC2.28 58.17,20.95 61.63,24.42 61.63,26.83 62.99,28.19 65.4,28.19 65.44,28.23 | 45.21,31.75 45.21,32.13 44.84,32.5 IC3.P$7 | R5.1 47.37,32.13 46.99,31.75 45.21,31.75
  Bottom 0.254: IC2.28 IC2.28A
SPEAKER
  Top 0.254: IC2.26A 53.21,14.61 41.02,14.61 38.1,17.53 36.03,17.53 SPK1.+
  Bottom 0.254: IC2.26A IC2.26
SW_CENTER
  Top 0.254: SW1.P$2 20.45,18.41 IC2.14
  Bottom 0.254: IC2.14 IC2.14A
SW_DOWN
  Top 0.254: IC2.12 16.89,23.5 2.03,8.64 2.03,5.97 SW1.P$4
  Bottom 0.254: IC2.12A IC2.12
SW_LEFT
  Top 0.254: SW1.P$1 21.01,20.95 IC2.13
  Bottom 0.254: IC2.13 IC2.13A
SW_RIGHT  (via drill 0.41)
  Top 0.254: SW1.P$6 6.73,1.27 v7.62,1.27
  Bottom 0.254: IC2.16A IC2.16 19.68,13.34 v7.62,1.27
SW_UP
  Top 0.254: SW1.P$3 19.89,15.88 IC2.15
  Bottom 0.254: IC2.15A IC2.15
TD+
  Top 0.152: IC2.TD+ 58.93,35.56 64.39,35.56 67.82,35.56 69.42,37.16 CON3.1
  Bottom 0.254: IC2.TD+A IC2.TD+
TD-
  Top 0.152: IC2.TD- 65.02,36.2 66.88,38.05 CON3.2
  Bottom 0.254: IC2.TD-A IC2.TD-
VBUS_USB_A  (via drill 0.41)
  Top 0.254: D3.K 35.67,37.97
  Top 0.406: D5.K D4.K D3.K | 35.67,37.97 v33.4,37.97
  Bottom 0.406: X1.VBUS 62.04,48.32 61.72,48.01 61.34,47.62 53.09,47.62 51.69,46.23 51.69,41.91 47.75,37.97 v33.4,37.97
VBUS_USB_B  (via drill 0.41)
  Top 0.406: D2.A D3.A 46.71,38 51.31,33.4 v51.31,30.61 | v73.28,20.95 74.22,21.89 CON7.VBUS
  Bottom 0.406: v51.31,30.61 51.31,28.19 52.32,27.3 61.59,27.3 67.94,20.95 v73.28,20.95
XBEE_NRST
  Bottom 0.406: IC2.30A IC2.30 58.67,26.04 59.05,26.42 61.09,26.42 63.75,23.75 67.56,19.94 74.04,19.94 75.44,21.34 75.44,31.37 76.58,32.51 76.58,34.05 U$2.5
XBEE_RX  (via drill 0.41)
  Top 0.254: v58.8,17.14 60.07,15.88 62.1,15.88 64.64,13.34 v83.69,13.34
  Bottom 0.254: IC2.10 IC2.10A 34.67,28.57 37.21,26.04 46.1,17.14 v58.8,17.14 | v83.69,13.34 84.33,13.34 84.71,13.72 84.71,31.46 84.71,32.05 U$2.2
XBEE_STATUS  (via drill 0.41, 0.41 pad 0.41)
  Top 0.406: IC2.29A IC2.29 | v58.93,18.54 60.83,16.64 v62.74,16.64
  Bottom 0.406: v62.74,16.64 65.28,14.22 74.17,14.22 74.55,13.84 74.55,12.21 U$2.15 | v58.93,18.54 58.8,18.67 58.8,21.72 IC2.29
XBEE_TX  (via drill 0.41)
  Top 0.254: v63.25,32.89 80.39,32.89 80.64,33.15 U$2.3
  Bottom 0.254: IC2.9 IC2.9A 35.56,31.11 36.2,31.75 36.96,32.51 59.69,32.51 60.33,32.51 60.83,32 61.98,32 62.36,32 v63.25,32.89

### Text on the board
tNames: X1 | LCD1 | CON3 | IC3 | CON9 | IC4 | SPK1 | CON8 | SW1 | CON2 | CON4 | CON5 | CON6 | VR1 | VR2
TopSilkscreen: GND | VOUT | DC In | Accelerometer | MMA7660 | 3 Axis 1.5g | Zigbee (Xbee) | Wifi (RN-XV) | Temperature | 128x32 LCD | LM75BD | USB | Host | USB | Device | Joystick | Out | In | Pot 1 | Pot 2 | p20 | p21 | PWM1 | PWM2 | RGB
BottomSilkscreen: DC In | MOSI : p5 | LCD | RESET : p6 | C12832A1Z | - | + | SCK : p7 | A0 : p8 | 6-9v DC | nCS : p11 | TX : p9 | Zigbee (Xbee) | RX : p10 | Wifi (RN-XV) | STATUS : p29 | nRESET : p30 | DOWN : P12 | Joystick | Application Board | LEFT : p13 | CENTER : p14 | UP : p15 | RIGHT : p16 | mbed-014.1 | HPI-0315B | ANALOG IN : p17 | ANALOG OUT : p18 | Pot 1 : p19 | Pot 2 : p20 | PWM1 : p21 | PWM2 : p22 | RED : p23 | RGB LED | GREEN : p24 | BLUE : p25 | Speaker : p26 | I2C SCL : p27 | Accel'meter | I2C SDA : p28 | Address : 0x98 | MMA7660 | 1 | 2 | I2C SCL : p27 | Tmperature | PWM | I2C SDA : p28 | Out | In | Address : 0x90 | LM75BD | DC In | GND | http://mbed.org/cookbook/mbed-application-board